# Altium schematic sheet MCU.SchDoc
size A3; PageSetup: Record=PageOptions|CenterHorizontal=True|CenterVertical=True|PrintScale=0.49|XCorrection=1.00|YCorrection=1.00|PrintKind=0|BorderSize=5000000|LeftOffset=0|BottomOffset=0|Orientation=2|PaperLength=1000|PaperWidth=1000|Scale=100|PaperSource=7|PrintQuality=600|MediaType=1|DitherType=10|PaperKind=A3|PrintScaleMode=1; SheetTitle: Sheet Title
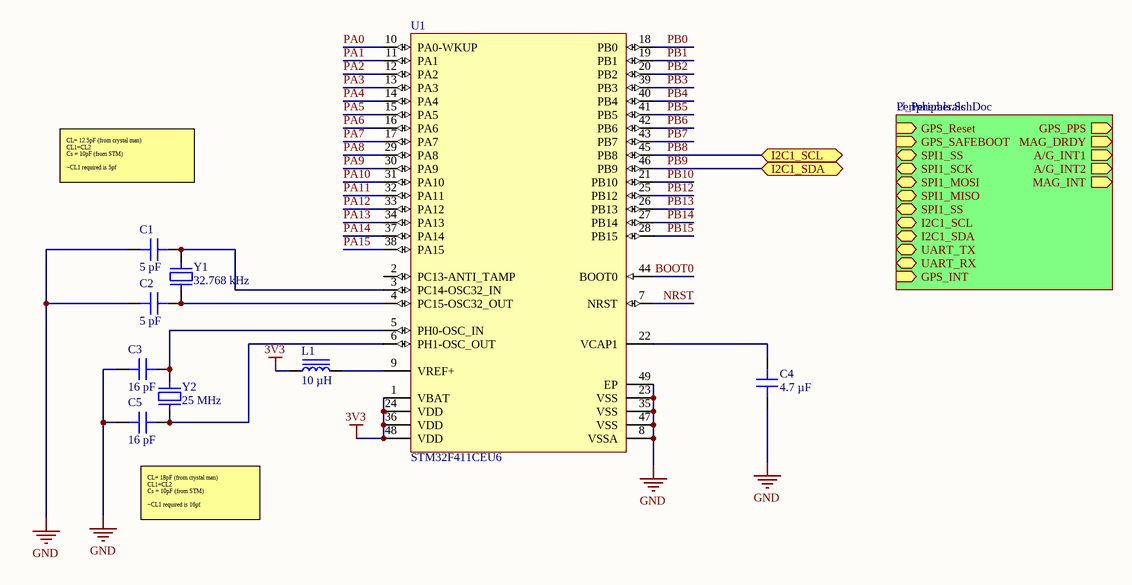
[diagram p0: MCU.SchDoc]

## Parts
C1  5 pF  [CAP 0603_1608]
C2  5 pF  [CAP 0603_1608]
C3  16 pF  [CAP 0603_1608]
C4  4.7 µF  [CAP 0603_1608]
C5  16 pF  [CAP 0603_1608]
L1  10 µH  [BOURNS SRR1280]
U1  STM32F411CEU6  [STM-UFQFPN48_L]
Y1  32.768 kHz  [MICRO CRYSTAL CM8V H0.6mm]
Y2  25 MHz  [ABRACON ABLS]

## Sub-sheets
U_Peripherals = Peripherals.SchDoc: GPS_Reset (in), GPS_PPS (out), GPS_SAFEBOOT (in), SPI1_SS (bidir), SPI1_SCK (bidir), SPI1_MOSI (bidir), SPI1_MISO (bidir), SPI1_SS (bidir), I2C1_SCL (bidir), I2C1_SDA (bidir), UART_TX (bidir), UART_RX (bidir), MAG_DRDY (out), A/G_INT1 (out), A/G_INT2 (out), MAG_INT (out), GPS_INT (in)

## Ports
I2C1_SCL (bidir), I2C1_SDA (bidir)

## Nets
3V3: L1.1 U1.1(VBAT) U1.24(VDD) U1.36(VDD) U1.48(VDD)
GND: C1.1 C2.1 C3.1 C4.1 C5.1 U1.8(VSSA) U1.23(VSS) U1.35(VSS) U1.47(VSS) U1.49(EP)
BOOT0: U1.44(BOOT0)
NRST: U1.7(NRST)
PA0: U1.10(PA0-WKUP)
PA1: U1.11(PA1)
PA2: U1.12(PA2)
PA3: U1.13(PA3)
PA4: U1.14(PA4)
PA5: U1.15(PA5)
PA6: U1.16(PA6)
PA7: U1.17(PA7)
PA8: U1.29(PA8)
PA9: U1.30(PA9)
PA10: U1.31(PA10)
PA11: U1.32(PA11)
PA12: U1.33(PA12)
PA13: U1.34(PA13)
PA14: U1.37(PA14)
PA15: U1.38(PA15)
PB0: U1.18(PB0)
PB1: U1.19(PB1)
PB2: U1.20(PB2)
PB3: U1.39(PB3)
PB4: U1.40(PB4)
PB5: U1.41(PB5)
PB6: U1.42(PB6)
PB7: U1.43(PB7)
PB8: U1.45(PB8) ; port I2C1_SCL
PB9: U1.46(PB9) ; port I2C1_SDA
PB10: U1.21(PB10)
PB12: U1.25(PB12)
PB13: U1.26(PB13)
PB14: U1.27(PB14)
PB15: U1.28(PB15)
NetC1_2: C1.2 U1.3(PC14-OSC32_IN) Y1.2
NetC2_2: C2.2 U1.4(PC15-OSC32_OUT) Y1.1
NetC3_2: C3.2 U1.5(PH0-OSC_IN) Y2.2
NetC4_2: C4.2 U1.22(VCAP1)
NetC5_2: C5.2 U1.6(PH1-OSC_OUT) Y2.1
NetL1_2: L1.2 U1.9(VREF+)

Not connected (* = marked no-connect by the designer): U1 2(PC13-ANTI_TAMP)

## Notes on the sheet
- CL= 12.5pF (from crystal man)
  CL1=CL2
  Cs = 10pF (from STM)
  ~CL1 required is 5pf
- CL= 18pF (from crystal man)
  CL1=CL2
  Cs = 10pF (from STM)
  ~CL1 required is 16pf

## Library data of the parts
C1 C2 = CGA3E2C0G1H050C080AD: CAP CER 5PF 50V 0603 EPOXY; manufacturer: TDK Corporation; Temperature Coefficient: C0G, NP0; Tolerance: ±0.25pF; Part Number: CGA3E2C0G1H050C080AD; Value: 5 pF; Applications: Automotive; Capacitance: 5 pF; componentlink1description: Datasheet; componentlink1url: https://product.tdk.com/info/en/catalog/datasheets/mlcc_automotive_epoxy_en.pdf?ref_disty=digikey; componentlink2description: DigiKey Link; componentlink2url: https://www.digikey.com/en/products/detail/tdk-corporation/CGA3E2C0G1H050C080AD/3933530; Device Package: 0603 (1608 Metric); Features: Epoxy Mountable; lastupdated: 9/02/2024 8:10:25 PM; Lifecycle Status: Active; Minimum Order: 1; Mounting Type: Surface Mount, MLCC, Epoxy; Operating Temperature: -55°C ~ 125°C; Package / Case: 0603 (1608 Metric); packaging: TapeAndReel; partid: 6295; Part Status: Active; price: 0.02; Ratings: AEC-Q200; series: CGA; Size / Dimension: 0.063" L x 0.031" W (1.60mm x 0.80mm); Supplier 1: DigiKey; Supplier Part Number 1: 445-9797-1-ND; Thickness (Max): 0.037" (0.95mm); Voltage - Rated: 50V
C3 C5 = C0603C160K3GAC7867: CAP CER 16PF 25V C0G/NP0 0603; manufacturer: KEMET; Temperature Coefficient: C0G, NP0; Tolerance: ±10%; Part Number: C0603C160K3GAC7867; Value: 16 pF; Applications: General Purpose; Capacitance: 16 pF; componentlink1description: Datasheet; componentlink1url: https://api.kemet.com/component-edge/download/datasheet/C0603C160K3GAC7867.pdf; componentlink2description: DigiKey Link; componentlink2url: https://www.digikey.com/en/products/detail/kemet/C0603C160K3GAC7867/12701360; Device Package: 0603 (1608 Metric); Features: Low ESL; lastupdated: 9/02/2024 8:09:58 PM; Lifecycle Status: Active; Minimum Order: 1; Mounting Type: Surface Mount, MLCC; Operating Temperature: -55°C ~ 125°C; Package / Case: 0603 (1608 Metric); packaging: TapeAndReel; partid: 35523; Part Status: Active; price: 0.04; series: SMD Comm C0G; Size / Dimension: 0.063" L x 0.031" W (1.60mm x 0.80mm); Supplier 1: DigiKey; Supplier Part Number 1: 399-C0603C160K3GAC7867CT-ND; Thickness (Max): 0.034" (0.87mm); Voltage - Rated: 25V
C4 = GRM185C80J475ME11D: CAP CER 4.7UF 6.3V X6S 0603; manufacturer: Murata Electronics; Tolerance: ±20%; Part Number: GRM185C80J475ME11D; Value: 4.7 µF; Applications: General Purpose; Capacitance: 4.7 µF; componentlink1description: Datasheet; componentlink1url: https://search.murata.co.jp/Ceramy/image/img/A01X/G101/ENG/GRM185C80J475ME11-01A.pdf; componentlink2description: DigiKey Link; componentlink2url: https://www.digikey.com/en/products/detail/murata-electronics/GRM185C80J475ME11D/10326313; Device Package: 0603 (1608 Metric); lastupdated: 9/02/2024 8:10:28 PM; Lifecycle Status: Active; Minimum Order: 1; Mounting Type: Surface Mount, MLCC; Operating Temperature: -55°C ~ 105°C; Package / Case: 0603 (1608 Metric); packaging: TapeAndReel; partid: 3976; Part Status: Active; price: 0.03; series: GRM; Size / Dimension: 0.063" L x 0.031" W (1.60mm x 0.80mm); Supplier 1: DigiKey; Supplier Part Number 1: 490-18660-1-ND; Temperature Coefficient: X6S; Thickness (Max): 0.022" (0.55mm); Voltage - Rated: 6.3V
L1 = SRR1280-100M: FIXED IND 10UH 6A 19.5 MOHM SMD; Manufacturer: Bourns Inc.; Current - Saturation: 6.3A; DC Resistance (DCR): 19.5mOhm Max; Frequency - Self Resonant: 17MHz; Inductance Frequency - Test: 100 kHz; Material - Core: Ferrite; Q @ Freq: 24 @ 2.52MHz; Shielding: Shielded; Tolerance: ±20%; Type: Drum Core, Wirewound; Part Number: SRR1280-100M; ComponentLink1Description: Datasheet; ComponentLink1URL: https://www.bourns.com/docs/Product-Datasheets/SRR1280.pdf; ComponentLink2Description: DigiKey Link; ComponentLink2URL: https://www.digikey.com/en/products/detail/bourns-inc/SRR1280-100M/1969992; Current Rating (Amps): 6 A; Device Package: Nonstandard; Height - Seated (Max): 0.315" (8.00mm); Inductance: 10 µH; LastUpdated: 11/03/2024 7:54:55 AM; Lifecycle Status: Active; Minimum Order: 1; Mounting Type: Surface Mount; Operating Temperature: -40°C ~ 125°C; Package / Case: Nonstandard; Packaging: TapeAndReel; PartId: 22; Part Status: Active; Price: 0.51; Series: SRR1280; Size / Dimension: 0.492" L x 0.492" W (12.50mm x 12.50mm); Supplier 1: DigiKey; Supplier Part Number 1: SRR1280-100MCT-ND; Value: 10 µH
U1 = CMP-0243-00165-1: ARM Cortex-M4 32-bit MCU+FPU, 512 KB Flash, 128 KB RAM, 36 I/Os, 48-Pin UFQFPN, -40 to 85 degC, Tray; Operating Frequency(F) (Processor speed) (MHz): 100; FLASH Size (Prog) (kB): 512; Internal RAM Size (kB): 128; I/Os (High Current): 36; Supply Voltage(Vcc) min (V): 1.7; Package Reference: 48-Pin Ultra Thin Fine Pitch Quad Flat No-Lead, 7 x 7 x 0.6 mm Body, 0.5 mm Pitch, Exposed Pad; ComponentLink1Description: Manufacturer URL; ComponentLink1URL: http://www.st.com/; Packing: Tray; Package Description: UFQFPN48; Core: ARM Cortex-M4; ComponentLink2Description: Datasheet; ComponentLink2URL: http://www.st.com/st-web-ui/static/active/en/resource/technical/document/datasheet/DM00115249.pdf; DatasheetVersion: Rev. 6; Mounting Technology: Surface Mount
Y1 = CM8V-T1A-32.768KHZ-12.5PF-20PPM-TB-QA: CRYSTAL 32.7680KHZ 12.5PF SMD; Manufacturer: Micro Crystal AG; ESR (Equivalent Series Resistance): 70 kOhms; Frequency Tolerance: ±20ppm; Operating Mode: Fundamental; Part Number: CM8V-T1A-32.768KHZ-12.5PF-20PPM-TB-QA; ComponentLink1Description: Datasheet; ComponentLink1URL: https://www.microcrystal.com/fileadmin/Media/Products/32kHz/Datasheet/CM8V-T1A.pdf; ComponentLink2Description: DigiKey Link; ComponentLink2URL: https://www.digikey.com/en/products/detail/micro-crystal-ag/CM8V-T1A-32-768KHZ-12-5PF-20PPM-TB-QA/10499237; Frequency: 32.768 kHz; Height - Seated (Max): 0.024" (0.60mm); LastUpdated: 11/03/2024 8:14:55 AM; Lifecycle Status: Active; Load Capacitance: 12.5pF; Minimum Order: 1; Mounting Type: Surface Mount; Operating Temperature: -40°C ~ 125°C; Package / Case: 2-SMD, No Lead; Packaging: TapeAndReel; PartId: 839; Part Status: Active; Price: 0.32; Ratings: AEC-Q200; Series: CM8V; Size / Dimension: 0.079" L x 0.047" W (2.00mm x 1.20mm); Supplier 1: DigiKey; Supplier Part Number 1: 2195-CM8V-T1A-32.768KHZ-12.5PF-20PPM-TB-QACT-ND; Type: kHz Crystal (Tuning Fork); Value: 32.768 kHz
Y2 = ABLS-25.000MHZ-K4F-T: CRYSTAL 25.0000MHZ 18PF SMD; Manufacturer: Abracon LLC; ESR (Equivalent Series Resistance): 40 Ohms; Frequency Stability: ±50ppm; Frequency Tolerance: ±30ppm; Operating Mode: Fundamental; Part Number: ABLS-25.000MHZ-K4F-T; ComponentLink1Description: Datasheet; ComponentLink1URL: https://abracon.com/Resonators/abls.pdf; ComponentLink2Description: DigiKey Link; ComponentLink2URL: https://www.digikey.com/en/products/detail/abracon-llc/ABLS-25-000MHZ-K4F-T/2001323; Frequency: 25 MHz; Height - Seated (Max): 0.165" (4.20mm); LastUpdated: 11/03/2024 7:54:13 AM; Lifecycle Status: Active; Load Capacitance: 18pF; Minimum Order: 1; Mounting Type: Surface Mount; Operating Temperature: -40°C ~ 125°C; Package / Case: HC-49/US; Packaging: TapeAndReel; PartId: 244; Part Status: Active; Price: 0.20; Series: ABLS; Size / Dimension: 0.449" L x 0.185" W (11.40mm x 4.70mm); Supplier 1: DigiKey; Supplier Part Number 1: 535-9956-1-ND; Type: MHz Crystal; Value: 25 MHz